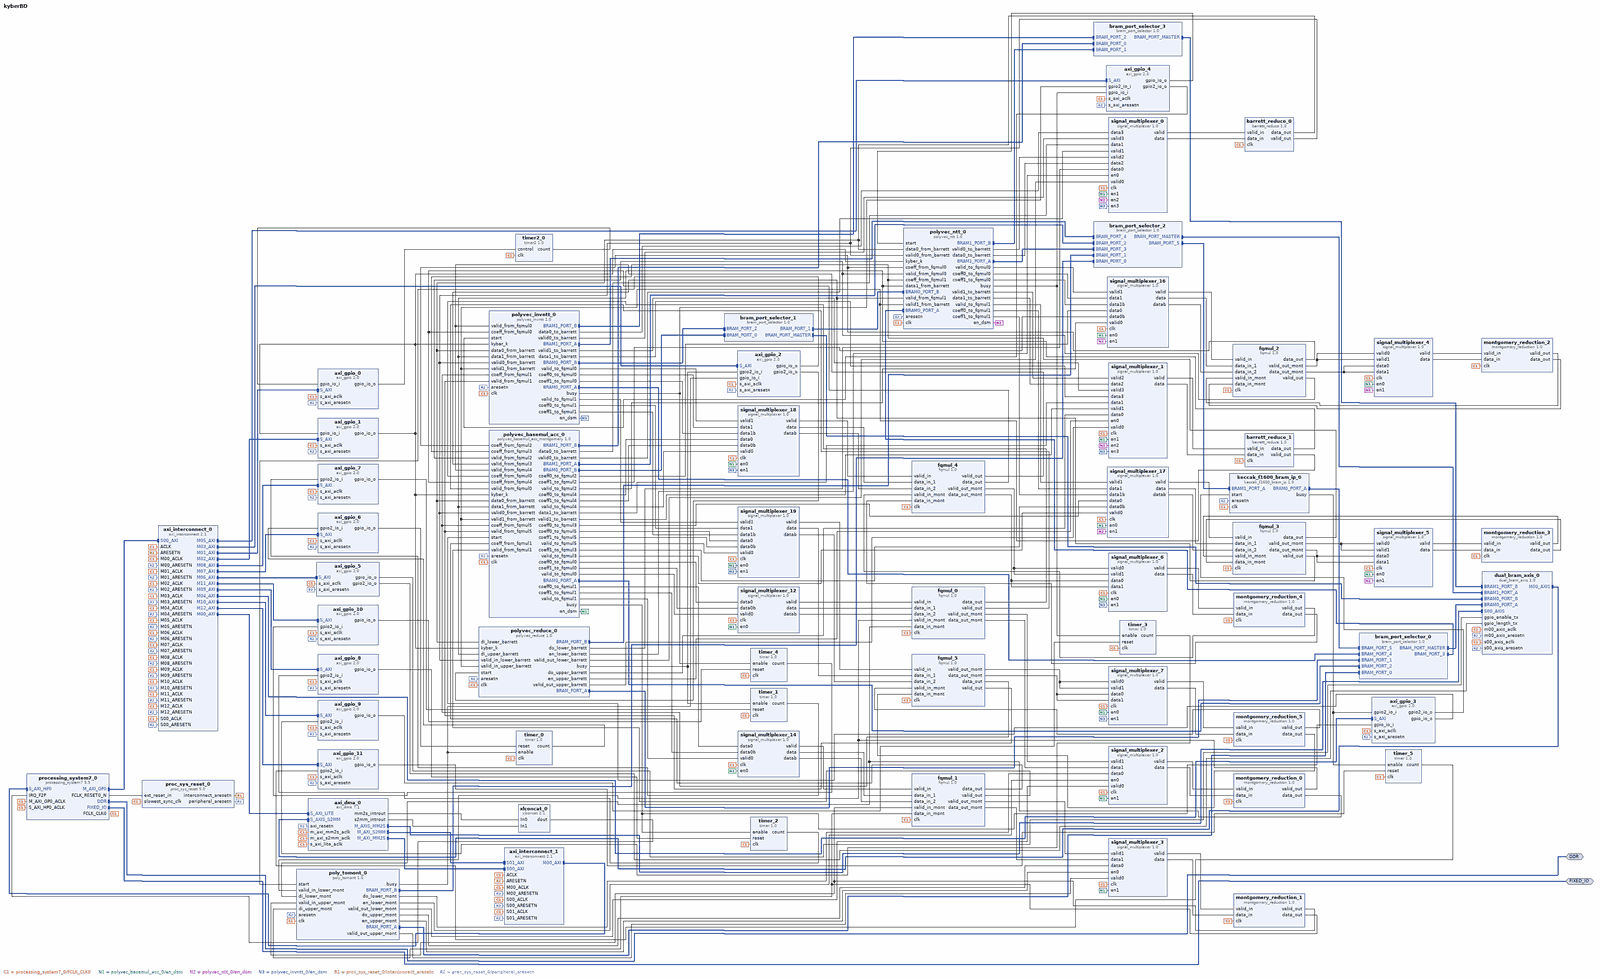
[diagram p0: block diagram of the top level, whole]
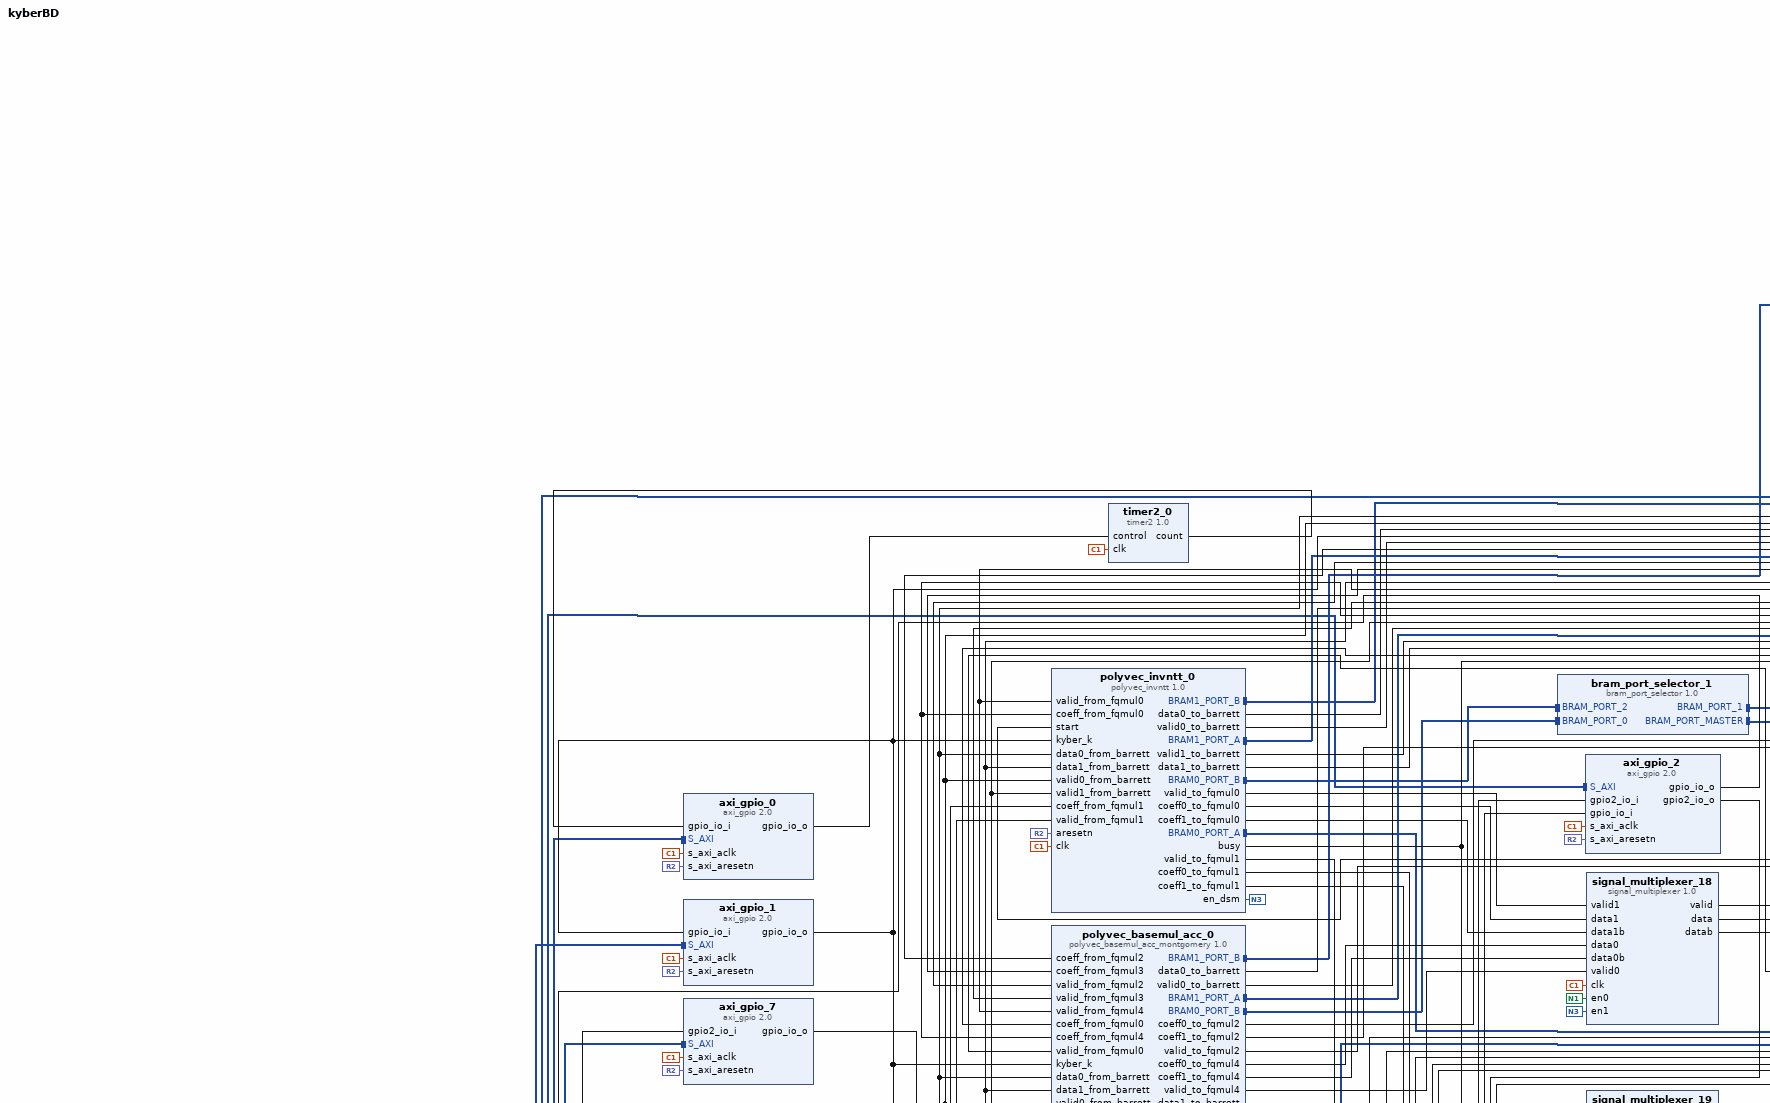
[diagram p1: block diagram of the top level, upper left part]
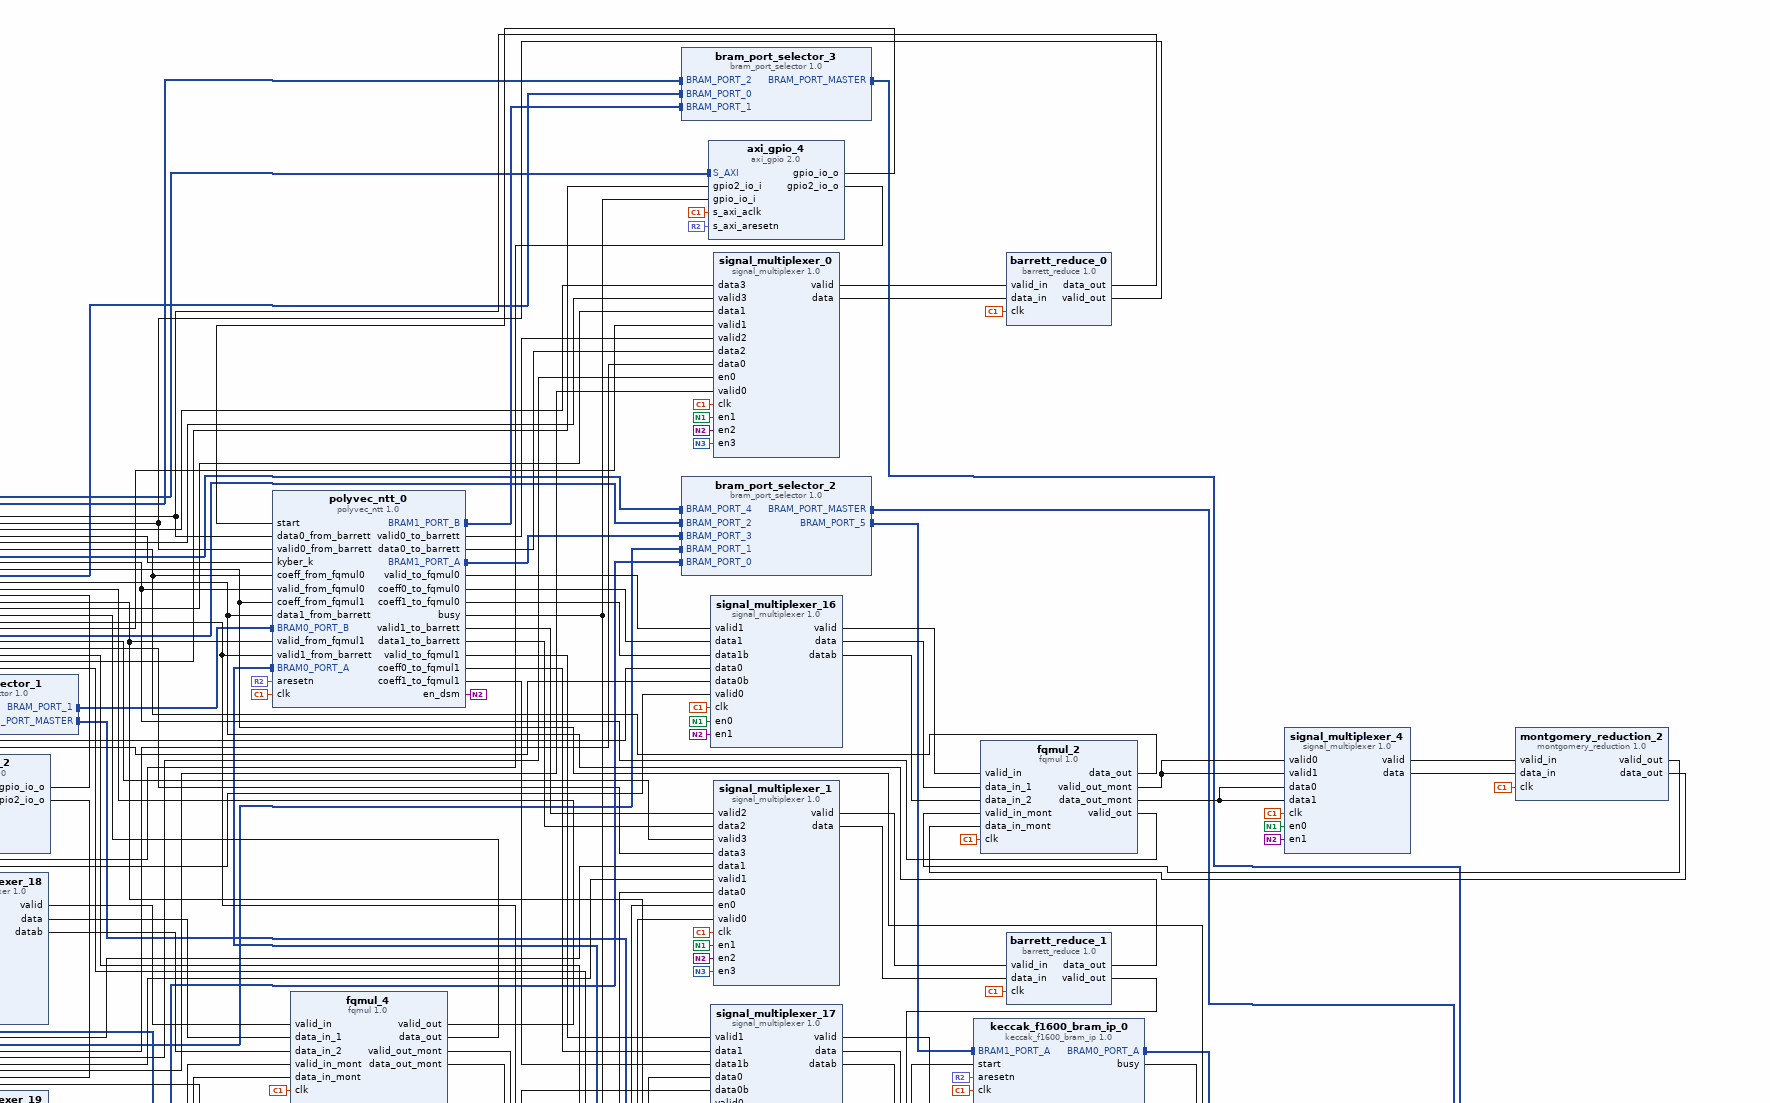
[diagram p2: block diagram of the top level, upper right part]
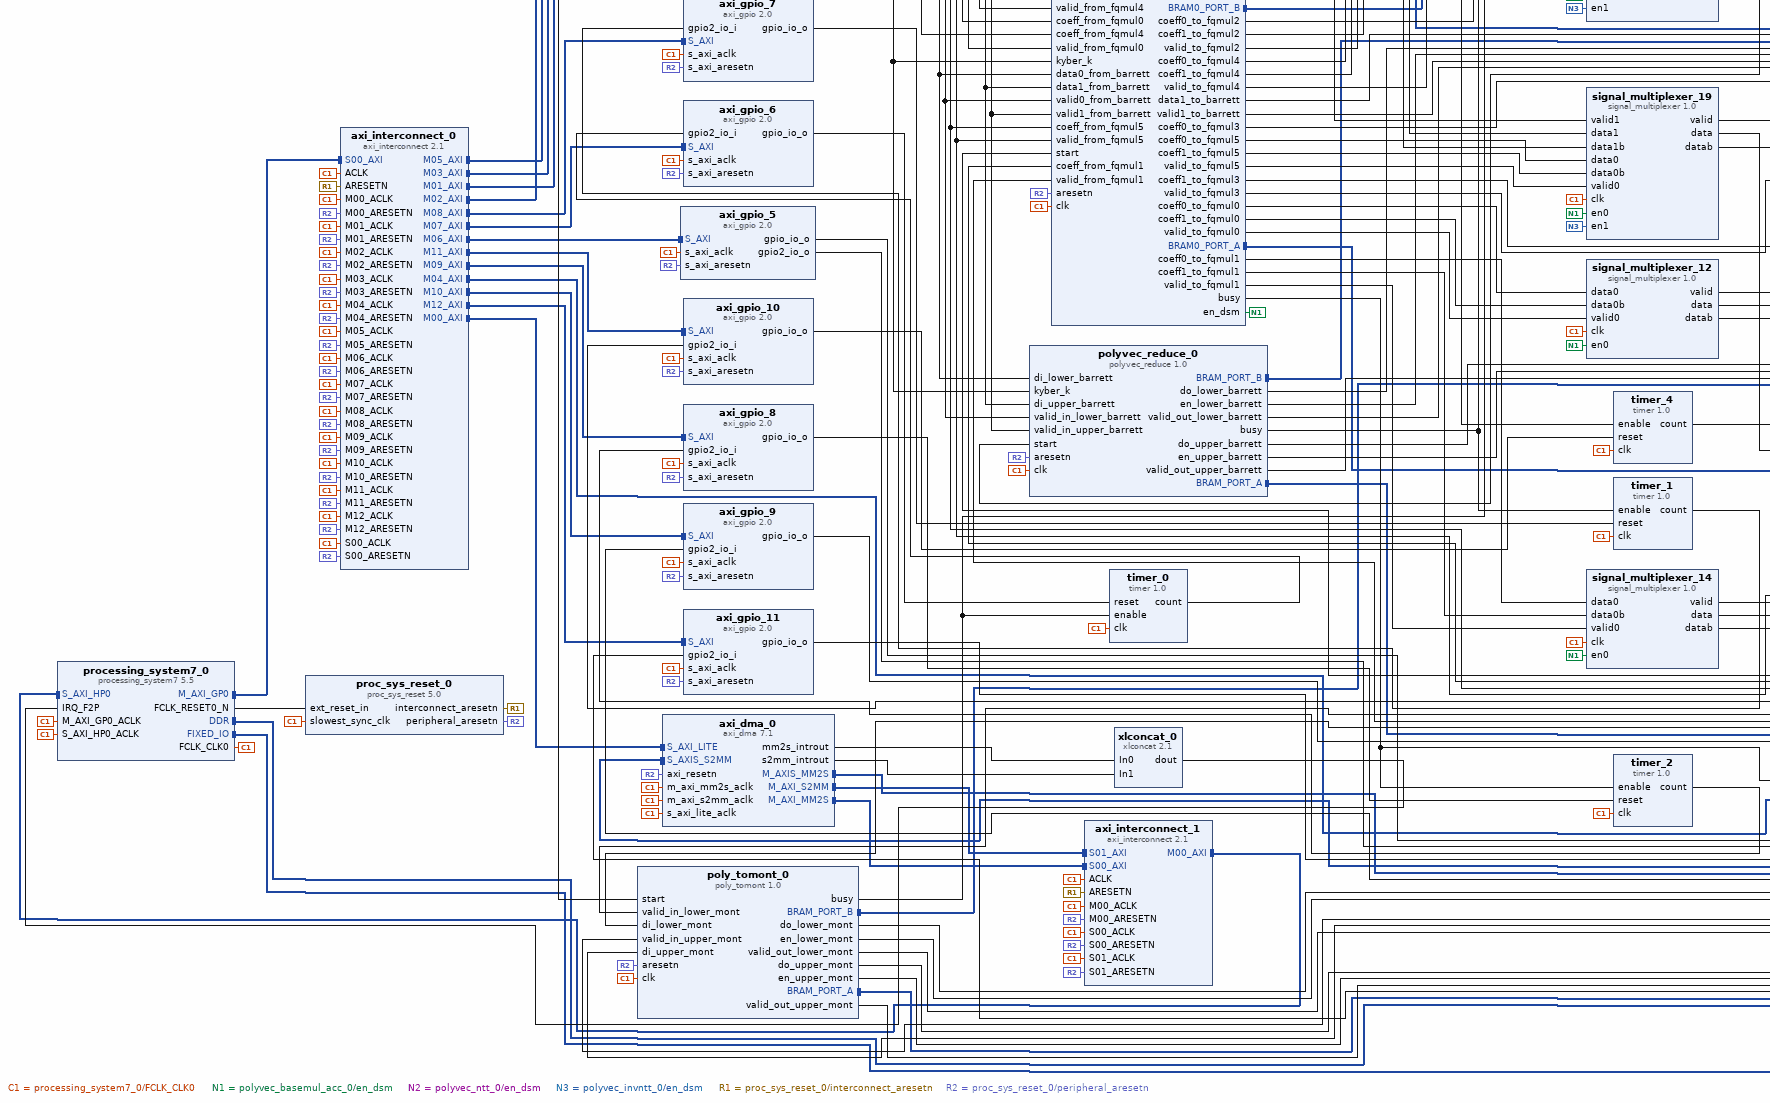
[diagram p3: block diagram of the top level, lower left part]
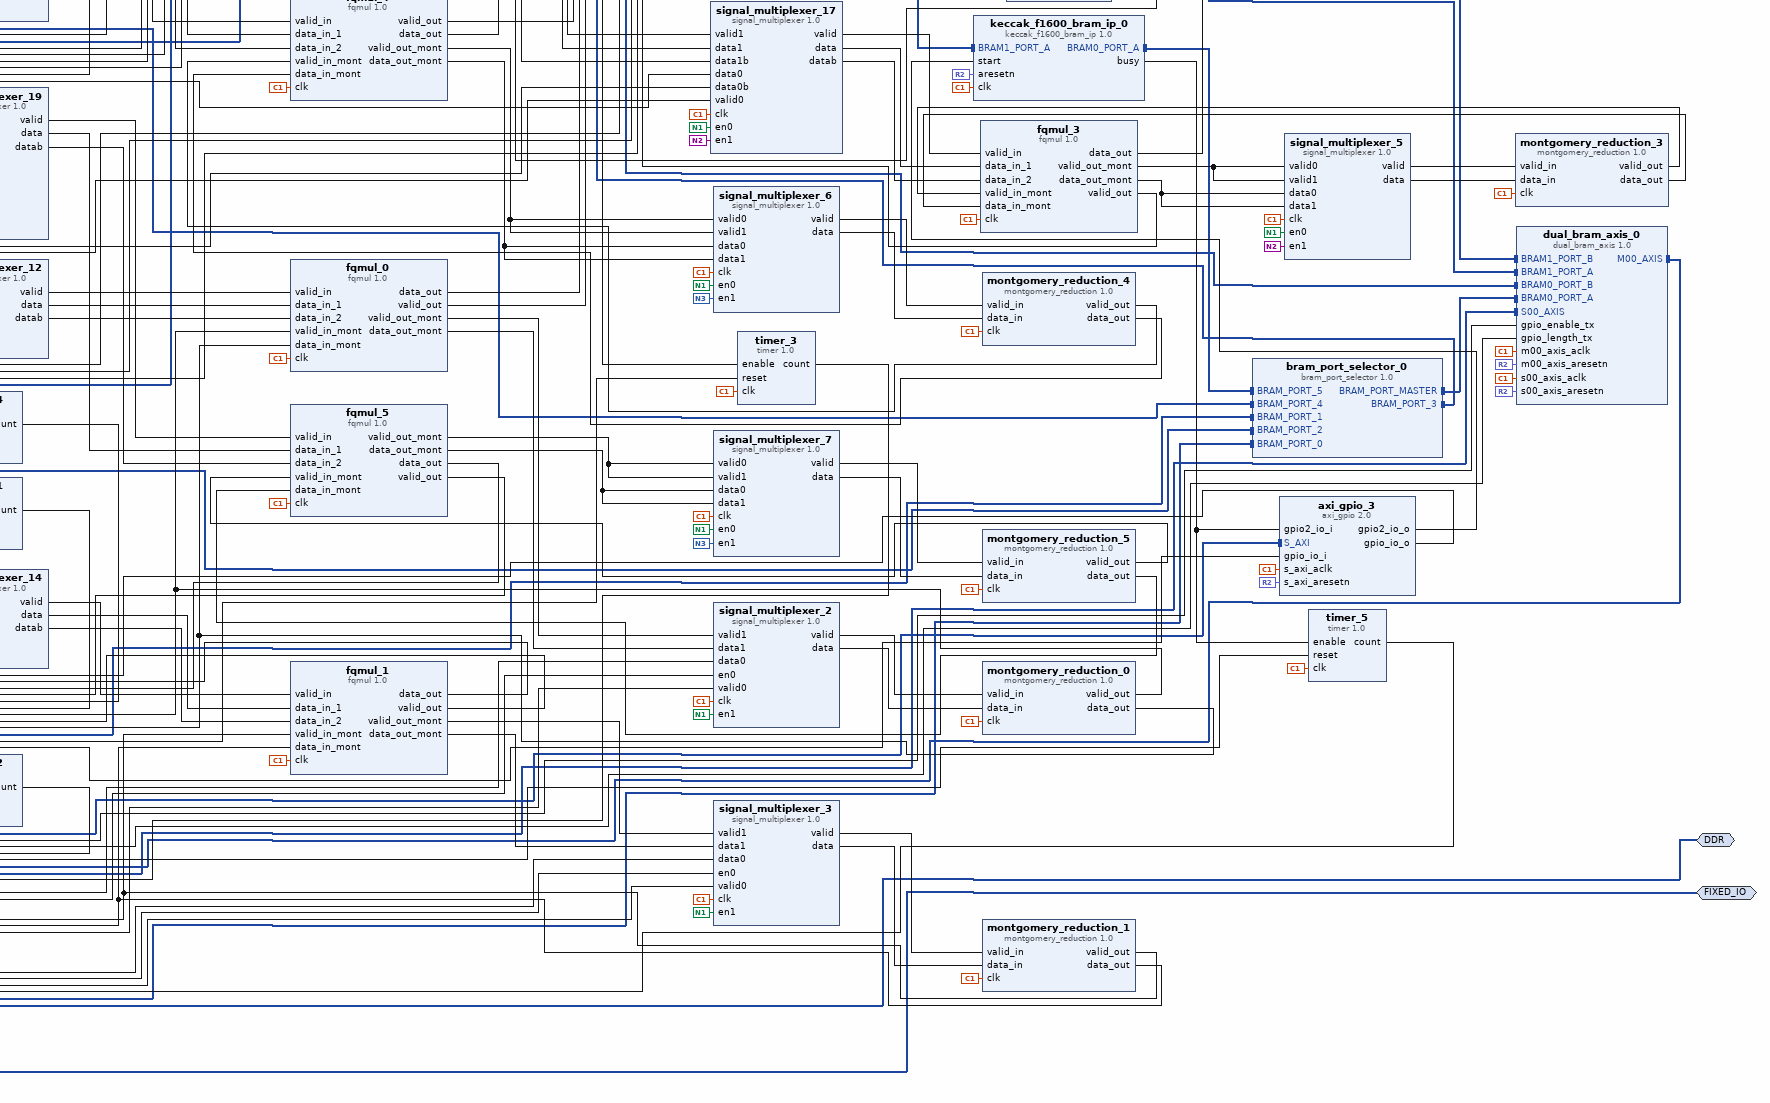
[diagram p4: block diagram of the top level, lower right part]
# Vivado block design kyberBD, xc7z010clg400-1, Vivado 2019.1
create_bd_design kyberBD

create_bd_intf_port -mode Master -vlnv xilinx.com:interface:ddrx_rtl:1.0 DDR
create_bd_intf_port -mode Master -vlnv xilinx.com:display_processing_system7:fixedio_rtl:1.0 FIXED_IO

create_bd_cell -type ip -vlnv xilinx.com:ip:processing_system7:5.5 processing_system7_0
set_property -dict [list \
  CONFIG.PCW_APU_PERIPHERAL_FREQMHZ 667 \
  CONFIG.PCW_ENET0_ENET0_IO {MIO 16 .. 27} \
  CONFIG.PCW_ENET0_GRP_MDIO_ENABLE 1 \
  CONFIG.PCW_ENET0_GRP_MDIO_IO {MIO 52 .. 53} \
  CONFIG.PCW_ENET0_PERIPHERAL_ENABLE 1 \
  CONFIG.PCW_ENET0_RESET_ENABLE 0 \
  CONFIG.PCW_ENET_RESET_ENABLE 1 \
  CONFIG.PCW_ENET_RESET_SELECT {Share reset pin} \
  CONFIG.PCW_FPGA0_PERIPHERAL_FREQMHZ 100 \
  CONFIG.PCW_FPGA1_PERIPHERAL_FREQMHZ 100 \
  CONFIG.PCW_FPGA2_PERIPHERAL_FREQMHZ 33.333333 \
  CONFIG.PCW_GPIO_MIO_GPIO_ENABLE 1 \
  CONFIG.PCW_GPIO_MIO_GPIO_IO MIO \
  CONFIG.PCW_GPIO_PERIPHERAL_ENABLE 1 \
  CONFIG.PCW_I2C_RESET_ENABLE 0 \
  CONFIG.PCW_IRQ_F2P_INTR 1 \
  CONFIG.PCW_PRESET_BANK1_VOLTAGE {LVCMOS 1.8V} \
  CONFIG.PCW_QSPI_GRP_FBCLK_ENABLE 1 \
  CONFIG.PCW_QSPI_GRP_FBCLK_IO {MIO 8} \
  CONFIG.PCW_QSPI_GRP_SINGLE_SS_ENABLE 1 \
  CONFIG.PCW_QSPI_GRP_SINGLE_SS_IO {MIO 1 .. 6} \
  CONFIG.PCW_QSPI_PERIPHERAL_ENABLE 1 \
  CONFIG.PCW_QSPI_QSPI_IO {MIO 1 .. 6} \
  CONFIG.PCW_SD0_GRP_CD_ENABLE 1 \
  CONFIG.PCW_SD0_GRP_CD_IO {MIO 46} \
  CONFIG.PCW_SD0_GRP_WP_ENABLE 1 \
  CONFIG.PCW_SD0_GRP_WP_IO {MIO 50} \
  CONFIG.PCW_SD0_PERIPHERAL_ENABLE 1 \
  CONFIG.PCW_SD0_SD0_IO {MIO 40 .. 45} \
  CONFIG.PCW_SDIO_PERIPHERAL_FREQMHZ 25 \
  CONFIG.PCW_SINGLE_QSPI_DATA_MODE x4 \
  CONFIG.PCW_S_AXI_HP0_DATA_WIDTH 32 \
  CONFIG.PCW_TTC0_PERIPHERAL_ENABLE 1 \
  CONFIG.PCW_TTC0_TTC0_IO EMIO \
  CONFIG.PCW_UART0_PERIPHERAL_ENABLE 1 \
  CONFIG.PCW_UART0_UART0_IO {MIO 14 .. 15} \
  CONFIG.PCW_UART1_PERIPHERAL_ENABLE 1 \
  CONFIG.PCW_UART1_UART1_IO {MIO 48 .. 49} \
  CONFIG.PCW_UART_PERIPHERAL_FREQMHZ 50 \
  CONFIG.PCW_UIPARAM_DDR_PARTNO {MT41K256M16 RE-125} \
  CONFIG.PCW_USB0_PERIPHERAL_ENABLE 1 \
  CONFIG.PCW_USB0_RESET_ENABLE 1 \
  CONFIG.PCW_USB0_RESET_IO {MIO 7} \
  CONFIG.PCW_USB0_USB0_IO {MIO 28 .. 39} \
  CONFIG.PCW_USB_RESET_ENABLE 1 \
  CONFIG.PCW_USB_RESET_SELECT {Share reset pin} \
  CONFIG.PCW_USE_FABRIC_INTERRUPT 1 \
  CONFIG.PCW_USE_S_AXI_HP0 1 \
] [get_bd_cells processing_system7_0]
# 281 more settings of processing_system7_0 are not shown: defaults, MIO pin electricals, DDR timing, and values the tool derives
create_bd_cell -type ip -vlnv xilinx.com:ip:proc_sys_reset:5.0 proc_sys_reset_0
create_bd_cell -type ip -vlnv xilinx.com:ip:axi_interconnect:2.1 axi_interconnect_0
set_property -dict {CONFIG.NUM_MI 13} [get_bd_cells axi_interconnect_0]
create_bd_cell -type ip -vlnv xilinx.com:ip:axi_gpio:2.0 axi_gpio_0
set_property -dict [list \
  CONFIG.C_ALL_INPUTS 0 \
  CONFIG.C_ALL_OUTPUTS 0 \
  CONFIG.C_GPIO_WIDTH 32 \
  CONFIG.C_IS_DUAL 0 \
] [get_bd_cells axi_gpio_0]
create_bd_cell -type ip -vlnv xilinx.com:ip:axi_gpio:2.0 axi_gpio_1
set_property -dict [list \
  CONFIG.C_ALL_INPUTS 0 \
  CONFIG.C_ALL_OUTPUTS 0 \
  CONFIG.C_GPIO_WIDTH 3 \
  CONFIG.C_IS_DUAL 0 \
] [get_bd_cells axi_gpio_1]
create_bd_cell -type ip -vlnv xilinx.com:ip:axi_gpio:2.0 axi_gpio_2
set_property -dict {CONFIG.C_GPIO2_WIDTH 1 CONFIG.C_GPIO_WIDTH 1 CONFIG.C_IS_DUAL 1} [get_bd_cells axi_gpio_2]
create_bd_cell -type ip -vlnv xilinx.com:ip:axi_gpio:2.0 axi_gpio_3
set_property -dict {CONFIG.C_GPIO2_WIDTH 1 CONFIG.C_GPIO_WIDTH 1 CONFIG.C_IS_DUAL 1} [get_bd_cells axi_gpio_3]
create_bd_cell -type ip -vlnv xilinx.com:user:barrett_reduce:1.0 barrett_reduce_0
create_bd_cell -type ip -vlnv xilinx.com:user:barrett_reduce:1.0 barrett_reduce_1
create_bd_cell -type ip -vlnv xilinx.com:user:fqmul:1.0 fqmul_0
create_bd_cell -type ip -vlnv xilinx.com:user:fqmul:1.0 fqmul_1
create_bd_cell -type ip -vlnv xilinx.com:user:fqmul:1.0 fqmul_2
create_bd_cell -type ip -vlnv xilinx.com:user:fqmul:1.0 fqmul_3
create_bd_cell -type ip -vlnv xilinx.com:user:fqmul:1.0 fqmul_4
create_bd_cell -type ip -vlnv xilinx.com:user:fqmul:1.0 fqmul_5
create_bd_cell -type ip -vlnv xilinx.com:user:polyvec_reduce:1.0 polyvec_reduce_0
create_bd_cell -type ip -vlnv xilinx.com:user:timer2:1.0 timer2_0
create_bd_cell -type ip -vlnv xilinx.com:ip:axi_gpio:2.0 axi_gpio_4
set_property -dict {CONFIG.C_GPIO2_WIDTH 1 CONFIG.C_GPIO_WIDTH 1 CONFIG.C_IS_DUAL 1} [get_bd_cells axi_gpio_4]
create_bd_cell -type ip -vlnv xilinx.com:user:signal_multiplexer:1.0 signal_multiplexer_0
set_property -dict {CONFIG.DATA_WIDTH 16 CONFIG.NUMBER_OF_CHANNELS 4} [get_bd_cells signal_multiplexer_0]
create_bd_cell -type ip -vlnv xilinx.com:user:signal_multiplexer:1.0 signal_multiplexer_1
set_property -dict {CONFIG.DATA_WIDTH 16 CONFIG.NUMBER_OF_CHANNELS 4} [get_bd_cells signal_multiplexer_1]
create_bd_cell -type ip -vlnv xilinx.com:user:signal_multiplexer:1.0 signal_multiplexer_12
set_property -dict [list \
  CONFIG.DATA_WIDTH 16 \
  CONFIG.ENABLE_SECOND_DATA_CHANNEL true \
  CONFIG.NUMBER_OF_CHANNELS 1 \
] [get_bd_cells signal_multiplexer_12]
create_bd_cell -type ip -vlnv xilinx.com:user:signal_multiplexer:1.0 signal_multiplexer_14
set_property -dict [list \
  CONFIG.DATA_WIDTH 16 \
  CONFIG.ENABLE_SECOND_DATA_CHANNEL true \
  CONFIG.NUMBER_OF_CHANNELS 1 \
] [get_bd_cells signal_multiplexer_14]
create_bd_cell -type ip -vlnv xilinx.com:user:signal_multiplexer:1.0 signal_multiplexer_16
set_property -dict [list \
  CONFIG.DATA_WIDTH 16 \
  CONFIG.ENABLE_SECOND_DATA_CHANNEL true \
  CONFIG.NUMBER_OF_CHANNELS 2 \
] [get_bd_cells signal_multiplexer_16]
create_bd_cell -type ip -vlnv xilinx.com:user:signal_multiplexer:1.0 signal_multiplexer_17
set_property -dict [list \
  CONFIG.DATA_WIDTH 16 \
  CONFIG.ENABLE_SECOND_DATA_CHANNEL true \
  CONFIG.NUMBER_OF_CHANNELS 2 \
] [get_bd_cells signal_multiplexer_17]
create_bd_cell -type ip -vlnv xilinx.com:user:signal_multiplexer:1.0 signal_multiplexer_18
set_property -dict [list \
  CONFIG.DATA_WIDTH 16 \
  CONFIG.ENABLE_SECOND_DATA_CHANNEL true \
  CONFIG.NUMBER_OF_CHANNELS 2 \
] [get_bd_cells signal_multiplexer_18]
create_bd_cell -type ip -vlnv xilinx.com:user:signal_multiplexer:1.0 signal_multiplexer_19
set_property -dict [list \
  CONFIG.DATA_WIDTH 16 \
  CONFIG.ENABLE_SECOND_DATA_CHANNEL true \
  CONFIG.NUMBER_OF_CHANNELS 2 \
] [get_bd_cells signal_multiplexer_19]
create_bd_cell -type ip -vlnv xilinx.com:user:signal_multiplexer:1.0 signal_multiplexer_2
create_bd_cell -type ip -vlnv xilinx.com:user:signal_multiplexer:1.0 signal_multiplexer_3
create_bd_cell -type ip -vlnv xilinx.com:user:signal_multiplexer:1.0 signal_multiplexer_4
set_property -dict {CONFIG.NUMBER_OF_CHANNELS 2} [get_bd_cells signal_multiplexer_4]
create_bd_cell -type ip -vlnv xilinx.com:user:signal_multiplexer:1.0 signal_multiplexer_5
set_property -dict {CONFIG.NUMBER_OF_CHANNELS 2} [get_bd_cells signal_multiplexer_5]
create_bd_cell -type ip -vlnv xilinx.com:user:signal_multiplexer:1.0 signal_multiplexer_6
set_property -dict {CONFIG.NUMBER_OF_CHANNELS 2} [get_bd_cells signal_multiplexer_6]
create_bd_cell -type ip -vlnv xilinx.com:user:signal_multiplexer:1.0 signal_multiplexer_7
set_property -dict {CONFIG.NUMBER_OF_CHANNELS 2} [get_bd_cells signal_multiplexer_7]
create_bd_cell -type ip -vlnv xilinx.com:user:montgomery_reduction:1.0 montgomery_reduction_0
create_bd_cell -type ip -vlnv xilinx.com:user:montgomery_reduction:1.0 montgomery_reduction_1
create_bd_cell -type ip -vlnv xilinx.com:user:montgomery_reduction:1.0 montgomery_reduction_2
create_bd_cell -type ip -vlnv xilinx.com:user:montgomery_reduction:1.0 montgomery_reduction_3
create_bd_cell -type ip -vlnv xilinx.com:user:montgomery_reduction:1.0 montgomery_reduction_4
create_bd_cell -type ip -vlnv xilinx.com:user:montgomery_reduction:1.0 montgomery_reduction_5
create_bd_cell -type ip -vlnv xilinx.com:ip:axi_dma:7.1 axi_dma_0
set_property -dict {CONFIG.c_include_sg 0 CONFIG.c_micro_dma 0 CONFIG.c_sg_length_width 22} [get_bd_cells axi_dma_0]
create_bd_cell -type ip -vlnv xilinx.com:ip:xlconcat:2.1 xlconcat_0
create_bd_cell -type ip -vlnv xilinx.com:ip:axi_gpio:2.0 axi_gpio_5
set_property -dict [list \
  CONFIG.C_ALL_OUTPUTS 1 \
  CONFIG.C_ALL_OUTPUTS_2 1 \
  CONFIG.C_GPIO_WIDTH 1 \
  CONFIG.C_IS_DUAL 1 \
] [get_bd_cells axi_gpio_5]
create_bd_cell -type ip -vlnv xilinx.com:user:poly_tomont:1.0 poly_tomont_0
set_property -dict {CONFIG.ADDR_WIDTH 11} [get_bd_cells poly_tomont_0]
create_bd_cell -type ip -vlnv xilinx.com:user:polyvec_basemul_acc_montgomery:1.0 polyvec_basemul_acc_0
create_bd_cell -type ip -vlnv xilinx.com:user:bram_port_selector:1.0 bram_port_selector_0
set_property -dict {CONFIG.ADDR_WIDTH 11 CONFIG.NUMBER_OF_CHANNELS 6} [get_bd_cells bram_port_selector_0]
create_bd_cell -type ip -vlnv xilinx.com:user:bram_port_selector:1.0 bram_port_selector_1
set_property -dict {CONFIG.ADDR_WIDTH 11 CONFIG.NUMBER_OF_CHANNELS 3} [get_bd_cells bram_port_selector_1]
create_bd_cell -type ip -vlnv xilinx.com:user:bram_port_selector:1.0 bram_port_selector_3
set_property -dict {CONFIG.ADDR_WIDTH 11 CONFIG.NUMBER_OF_CHANNELS 3} [get_bd_cells bram_port_selector_3]
create_bd_cell -type ip -vlnv xilinx.com:user:bram_port_selector:1.0 bram_port_selector_2
set_property -dict {CONFIG.NUMBER_OF_CHANNELS 6} [get_bd_cells bram_port_selector_2]
create_bd_cell -type ip -vlnv xilinx.com:user:dual_bram_axis:1.0 dual_bram_axis_0
create_bd_cell -type ip -vlnv xilinx.com:user:keccak_f1600_bram_ip:1.0 keccak_f1600_bram_ip_0
create_bd_cell -type ip -vlnv xilinx.com:user:polyvec_invntt:1.0 polyvec_invntt_0
create_bd_cell -type ip -vlnv xilinx.com:user:polyvec_ntt:1.0 polyvec_ntt_0
create_bd_cell -type ip -vlnv xilinx.com:user:timer:1.0 timer_0
create_bd_cell -type ip -vlnv xilinx.com:user:timer:1.0 timer_1
create_bd_cell -type ip -vlnv xilinx.com:user:timer:1.0 timer_2
create_bd_cell -type ip -vlnv xilinx.com:user:timer:1.0 timer_3
create_bd_cell -type ip -vlnv xilinx.com:user:timer:1.0 timer_4
create_bd_cell -type ip -vlnv xilinx.com:user:timer:1.0 timer_5
create_bd_cell -type ip -vlnv xilinx.com:ip:axi_gpio:2.0 axi_gpio_6
set_property -dict [list \
  CONFIG.C_ALL_INPUTS_2 1 \
  CONFIG.C_ALL_OUTPUTS 1 \
  CONFIG.C_GPIO_WIDTH 1 \
  CONFIG.C_IS_DUAL 1 \
] [get_bd_cells axi_gpio_6]
create_bd_cell -type ip -vlnv xilinx.com:ip:axi_interconnect:2.1 axi_interconnect_1
set_property -dict {CONFIG.NUM_MI 1 CONFIG.NUM_SI 2} [get_bd_cells axi_interconnect_1]
create_bd_cell -type ip -vlnv xilinx.com:ip:axi_gpio:2.0 axi_gpio_7
set_property -dict [list \
  CONFIG.C_ALL_INPUTS_2 1 \
  CONFIG.C_ALL_OUTPUTS 1 \
  CONFIG.C_GPIO_WIDTH 1 \
  CONFIG.C_IS_DUAL 1 \
] [get_bd_cells axi_gpio_7]
create_bd_cell -type ip -vlnv xilinx.com:ip:axi_gpio:2.0 axi_gpio_8
set_property -dict [list \
  CONFIG.C_ALL_INPUTS_2 1 \
  CONFIG.C_ALL_OUTPUTS 1 \
  CONFIG.C_GPIO_WIDTH 1 \
  CONFIG.C_IS_DUAL 1 \
] [get_bd_cells axi_gpio_8]
create_bd_cell -type ip -vlnv xilinx.com:ip:axi_gpio:2.0 axi_gpio_9
set_property -dict [list \
  CONFIG.C_ALL_INPUTS_2 1 \
  CONFIG.C_ALL_OUTPUTS 1 \
  CONFIG.C_GPIO_WIDTH 1 \
  CONFIG.C_IS_DUAL 1 \
] [get_bd_cells axi_gpio_9]
create_bd_cell -type ip -vlnv xilinx.com:ip:axi_gpio:2.0 axi_gpio_10
set_property -dict [list \
  CONFIG.C_ALL_INPUTS_2 1 \
  CONFIG.C_ALL_OUTPUTS 1 \
  CONFIG.C_GPIO_WIDTH 1 \
  CONFIG.C_IS_DUAL 1 \
] [get_bd_cells axi_gpio_10]
create_bd_cell -type ip -vlnv xilinx.com:ip:axi_gpio:2.0 axi_gpio_11
set_property -dict [list \
  CONFIG.C_ALL_INPUTS_2 1 \
  CONFIG.C_ALL_OUTPUTS 1 \
  CONFIG.C_GPIO_WIDTH 1 \
  CONFIG.C_IS_DUAL 1 \
] [get_bd_cells axi_gpio_11]

# ---- connections ----

connect_bd_intf_net [get_bd_intf_pins axi_gpio_11/S_AXI] [get_bd_intf_pins axi_interconnect_0/M12_AXI]
connect_bd_intf_net [get_bd_intf_pins axi_gpio_8/S_AXI] [get_bd_intf_pins axi_interconnect_0/M09_AXI]
connect_bd_intf_net [get_bd_intf_pins axi_gpio_7/S_AXI] [get_bd_intf_pins axi_interconnect_0/M08_AXI]
connect_bd_intf_net [get_bd_intf_pins axi_gpio_9/S_AXI] [get_bd_intf_pins axi_interconnect_0/M10_AXI]
connect_bd_intf_net [get_bd_intf_pins processing_system7_0/S_AXI_HP0] [get_bd_intf_pins axi_interconnect_1/M00_AXI]
connect_bd_intf_net [get_bd_intf_pins bram_port_selector_2/BRAM_PORT_MASTER] [get_bd_intf_pins dual_bram_axis_0/BRAM1_PORT_A]
connect_bd_intf_net [get_bd_intf_pins polyvec_ntt_0/BRAM1_PORT_B] [get_bd_intf_pins bram_port_selector_3/BRAM_PORT_1]
connect_bd_intf_net [get_bd_intf_pins dual_bram_axis_0/S00_AXIS] [get_bd_intf_pins axi_dma_0/M_AXIS_MM2S]
connect_bd_intf_net [get_bd_intf_pins axi_dma_0/M_AXI_S2MM] [get_bd_intf_pins axi_interconnect_1/S01_AXI]
connect_bd_intf_net [get_bd_intf_pins bram_port_selector_0/BRAM_PORT_MASTER] [get_bd_intf_pins dual_bram_axis_0/BRAM0_PORT_A]
connect_bd_intf_net [get_bd_intf_pins bram_port_selector_1/BRAM_PORT_MASTER] [get_bd_intf_pins dual_bram_axis_0/BRAM0_PORT_B]
connect_bd_intf_net -intf_net polyvec_invntt_0_BRAM_PORT_B [get_bd_intf_pins polyvec_invntt_0/BRAM0_PORT_B] [get_bd_intf_pins bram_port_selector_1/BRAM_PORT_2]
connect_bd_intf_net [get_bd_intf_pins polyvec_basemul_acc_0/BRAM1_PORT_B] [get_bd_intf_pins bram_port_selector_3/BRAM_PORT_0]
connect_bd_intf_net [get_bd_intf_pins axi_interconnect_0/M04_AXI] [get_bd_intf_pins axi_gpio_3/S_AXI]
connect_bd_intf_net -intf_net polyvec_ntt_0_BRAM_PORT_B [get_bd_intf_pins bram_port_selector_1/BRAM_PORT_1] [get_bd_intf_pins polyvec_ntt_0/BRAM0_PORT_B]
connect_bd_intf_net [get_bd_intf_pins poly_tomont_0/BRAM_PORT_A] [get_bd_intf_pins bram_port_selector_0/BRAM_PORT_0]
connect_bd_intf_net [get_bd_intf_pins polyvec_invntt_0/BRAM1_PORT_A] [get_bd_intf_pins bram_port_selector_2/BRAM_PORT_4]
connect_bd_intf_net -intf_net polyvec_invntt_0_BRAM_PORT_A [get_bd_intf_pins polyvec_invntt_0/BRAM0_PORT_A] [get_bd_intf_pins bram_port_selector_0/BRAM_PORT_4]
connect_bd_intf_net -intf_net keccak_f1600_bram_ip_0_PORT_BRAM [get_bd_intf_pins keccak_f1600_bram_ip_0/BRAM0_PORT_A] [get_bd_intf_pins bram_port_selector_0/BRAM_PORT_5]
connect_bd_intf_net [get_bd_intf_pins polyvec_reduce_0/BRAM_PORT_A] [get_bd_intf_pins bram_port_selector_0/BRAM_PORT_1]
connect_bd_intf_net [get_bd_intf_pins polyvec_basemul_acc_0/BRAM0_PORT_A] [get_bd_intf_pins bram_port_selector_0/BRAM_PORT_2]
connect_bd_intf_net [get_bd_intf_pins polyvec_basemul_acc_0/BRAM0_PORT_B] [get_bd_intf_pins bram_port_selector_1/BRAM_PORT_0]
connect_bd_intf_net [get_bd_intf_pins processing_system7_0/M_AXI_GP0] [get_bd_intf_pins axi_interconnect_0/S00_AXI]
connect_bd_intf_net [get_bd_intf_pins axi_interconnect_0/M02_AXI] [get_bd_intf_pins axi_gpio_1/S_AXI]
connect_bd_intf_net [get_bd_intf_pins axi_dma_0/S_AXI_LITE] [get_bd_intf_pins axi_interconnect_0/M00_AXI]
connect_bd_intf_net [get_bd_intf_pins polyvec_ntt_0/BRAM1_PORT_A] [get_bd_intf_pins bram_port_selector_2/BRAM_PORT_3]
connect_bd_intf_net [get_bd_intf_pins bram_port_selector_2/BRAM_PORT_5] [get_bd_intf_pins keccak_f1600_bram_ip_0/BRAM1_PORT_A]
connect_bd_intf_net [get_bd_intf_pins polyvec_basemul_acc_0/BRAM1_PORT_A] [get_bd_intf_pins bram_port_selector_2/BRAM_PORT_2]
connect_bd_intf_net [get_bd_intf_ports DDR] [get_bd_intf_pins processing_system7_0/DDR]
connect_bd_intf_net -intf_net polyvec_ntt_0_BRAM_PORT_A [get_bd_intf_pins bram_port_selector_0/BRAM_PORT_3] [get_bd_intf_pins polyvec_ntt_0/BRAM0_PORT_A]
connect_bd_intf_net [get_bd_intf_pins bram_port_selector_3/BRAM_PORT_MASTER] [get_bd_intf_pins dual_bram_axis_0/BRAM1_PORT_B]
connect_bd_intf_net [get_bd_intf_pins polyvec_reduce_0/BRAM_PORT_B] [get_bd_intf_pins bram_port_selector_2/BRAM_PORT_1]
connect_bd_intf_net [get_bd_intf_pins polyvec_invntt_0/BRAM1_PORT_B] [get_bd_intf_pins bram_port_selector_3/BRAM_PORT_2]
connect_bd_intf_net [get_bd_intf_pins axi_gpio_5/S_AXI] [get_bd_intf_pins axi_interconnect_0/M06_AXI]
connect_bd_intf_net [get_bd_intf_pins poly_tomont_0/BRAM_PORT_B] [get_bd_intf_pins bram_port_selector_2/BRAM_PORT_0]
connect_bd_intf_net [get_bd_intf_pins dual_bram_axis_0/M00_AXIS] [get_bd_intf_pins axi_dma_0/S_AXIS_S2MM]
connect_bd_intf_net [get_bd_intf_ports FIXED_IO] [get_bd_intf_pins processing_system7_0/FIXED_IO]
connect_bd_intf_net [get_bd_intf_pins axi_gpio_6/S_AXI] [get_bd_intf_pins axi_interconnect_0/M07_AXI]
connect_bd_intf_net [get_bd_intf_pins axi_interconnect_0/M05_AXI] [get_bd_intf_pins axi_gpio_4/S_AXI]
connect_bd_intf_net [get_bd_intf_pins axi_gpio_10/S_AXI] [get_bd_intf_pins axi_interconnect_0/M11_AXI]
connect_bd_intf_net [get_bd_intf_pins axi_dma_0/M_AXI_MM2S] [get_bd_intf_pins axi_interconnect_1/S00_AXI]
connect_bd_intf_net [get_bd_intf_pins axi_interconnect_0/M03_AXI] [get_bd_intf_pins axi_gpio_2/S_AXI]
connect_bd_intf_net [get_bd_intf_pins axi_gpio_0/S_AXI] [get_bd_intf_pins axi_interconnect_0/M01_AXI]
connect_bd_net [get_bd_pins processing_system7_0/FCLK_RESET0_N] [get_bd_pins proc_sys_reset_0/ext_reset_in]
connect_bd_net [get_bd_pins axi_gpio_0/gpio_io_o] [get_bd_pins timer2_0/control]
connect_bd_net [get_bd_pins timer2_0/count] [get_bd_pins axi_gpio_0/gpio_io_i]
connect_bd_net [get_bd_pins poly_tomont_0/busy] [get_bd_pins axi_gpio_2/gpio_io_i] [get_bd_pins timer_0/enable]
connect_bd_net [get_bd_pins axi_gpio_2/gpio_io_o] [get_bd_pins poly_tomont_0/start]
connect_bd_net [get_bd_pins axi_gpio_1/gpio_io_o] \
  [get_bd_pins axi_gpio_1/gpio_io_i] [get_bd_pins polyvec_reduce_0/kyber_k] [get_bd_pins polyvec_basemul_acc_0/kyber_k] \
  [get_bd_pins polyvec_invntt_0/kyber_k] [get_bd_pins polyvec_ntt_0/kyber_k]
connect_bd_net [get_bd_pins axi_gpio_2/gpio2_io_o] [get_bd_pins polyvec_reduce_0/start]
connect_bd_net [get_bd_pins polyvec_reduce_0/busy] [get_bd_pins axi_gpio_2/gpio2_io_i] [get_bd_pins timer_1/enable]
connect_bd_net [get_bd_pins axi_gpio_3/gpio_io_o] [get_bd_pins polyvec_basemul_acc_0/start]
connect_bd_net [get_bd_pins polyvec_basemul_acc_0/busy] [get_bd_pins axi_gpio_3/gpio_io_i] [get_bd_pins timer_2/enable]
connect_bd_net [get_bd_pins processing_system7_0/FCLK_CLK0] \
  [get_bd_pins proc_sys_reset_0/slowest_sync_clk] [get_bd_pins processing_system7_0/M_AXI_GP0_ACLK] \
  [get_bd_pins axi_interconnect_0/M01_ACLK] [get_bd_pins axi_interconnect_0/M00_ACLK] \
  [get_bd_pins axi_interconnect_0/S00_ACLK] [get_bd_pins axi_interconnect_0/ACLK] [get_bd_pins axi_gpio_0/s_axi_aclk] \
  [get_bd_pins axi_gpio_1/s_axi_aclk] [get_bd_pins axi_interconnect_0/M02_ACLK] [get_bd_pins axi_interconnect_0/M03_ACLK] \
  [get_bd_pins axi_gpio_2/s_axi_aclk] [get_bd_pins axi_interconnect_0/M04_ACLK] [get_bd_pins axi_gpio_3/s_axi_aclk] \
  [get_bd_pins axi_interconnect_0/M05_ACLK] [get_bd_pins barrett_reduce_0/clk] [get_bd_pins barrett_reduce_1/clk] \
  [get_bd_pins fqmul_0/clk] [get_bd_pins fqmul_1/clk] [get_bd_pins fqmul_2/clk] [get_bd_pins fqmul_3/clk] \
  [get_bd_pins fqmul_4/clk] [get_bd_pins fqmul_5/clk] [get_bd_pins polyvec_reduce_0/clk] [get_bd_pins timer2_0/clk] \
  [get_bd_pins axi_gpio_4/s_axi_aclk] [get_bd_pins signal_multiplexer_0/clk] [get_bd_pins signal_multiplexer_1/clk] \
  [get_bd_pins signal_multiplexer_12/clk] [get_bd_pins signal_multiplexer_14/clk] [get_bd_pins signal_multiplexer_16/clk] \
  [get_bd_pins signal_multiplexer_17/clk] [get_bd_pins signal_multiplexer_18/clk] [get_bd_pins signal_multiplexer_19/clk] \
  [get_bd_pins signal_multiplexer_2/clk] [get_bd_pins signal_multiplexer_3/clk] [get_bd_pins signal_multiplexer_4/clk] \
  [get_bd_pins signal_multiplexer_5/clk] [get_bd_pins signal_multiplexer_6/clk] [get_bd_pins signal_multiplexer_7/clk] \
  [get_bd_pins montgomery_reduction_0/clk] [get_bd_pins montgomery_reduction_1/clk] [get_bd_pins montgomery_reduction_2/clk] \
  [get_bd_pins montgomery_reduction_3/clk] [get_bd_pins montgomery_reduction_4/clk] [get_bd_pins montgomery_reduction_5/clk] \
  [get_bd_pins axi_dma_0/s_axi_lite_aclk] [get_bd_pins axi_dma_0/m_axi_mm2s_aclk] \
  [get_bd_pins processing_system7_0/S_AXI_HP0_ACLK] [get_bd_pins axi_dma_0/m_axi_s2mm_aclk] \
  [get_bd_pins axi_gpio_5/s_axi_aclk] [get_bd_pins axi_interconnect_0/M06_ACLK] [get_bd_pins poly_tomont_0/clk] \
  [get_bd_pins polyvec_basemul_acc_0/clk] [get_bd_pins dual_bram_axis_0/m00_axis_aclk] \
  [get_bd_pins dual_bram_axis_0/s00_axis_aclk] [get_bd_pins keccak_f1600_bram_ip_0/clk] [get_bd_pins polyvec_invntt_0/clk] \
  [get_bd_pins polyvec_ntt_0/clk] [get_bd_pins timer_5/clk] [get_bd_pins timer_4/clk] [get_bd_pins timer_3/clk] \
  [get_bd_pins timer_2/clk] [get_bd_pins timer_1/clk] [get_bd_pins timer_0/clk] [get_bd_pins axi_gpio_6/s_axi_aclk] \
  [get_bd_pins axi_interconnect_0/M07_ACLK] [get_bd_pins axi_interconnect_0/M08_ACLK] \
  [get_bd_pins axi_interconnect_0/M09_ACLK] [get_bd_pins axi_interconnect_1/ACLK] [get_bd_pins axi_interconnect_1/S00_ACLK] \
  [get_bd_pins axi_interconnect_1/M00_ACLK] [get_bd_pins axi_interconnect_1/S01_ACLK] [get_bd_pins axi_gpio_11/s_axi_aclk] \
  [get_bd_pins axi_gpio_10/s_axi_aclk] [get_bd_pins axi_gpio_9/s_axi_aclk] [get_bd_pins axi_gpio_8/s_axi_aclk] \
  [get_bd_pins axi_gpio_7/s_axi_aclk] [get_bd_pins axi_interconnect_0/M10_ACLK] [get_bd_pins axi_interconnect_0/M11_ACLK] \
  [get_bd_pins axi_interconnect_0/M12_ACLK]
connect_bd_net [get_bd_pins poly_tomont_0/do_lower_mont] [get_bd_pins signal_multiplexer_2/data0]
connect_bd_net [get_bd_pins poly_tomont_0/en_lower_mont] [get_bd_pins signal_multiplexer_2/en0]
connect_bd_net [get_bd_pins poly_tomont_0/valid_out_lower_mont] [get_bd_pins signal_multiplexer_2/valid0]
connect_bd_net [get_bd_pins poly_tomont_0/do_upper_mont] [get_bd_pins signal_multiplexer_3/data0]
connect_bd_net [get_bd_pins poly_tomont_0/en_upper_mont] [get_bd_pins signal_multiplexer_3/en0]
connect_bd_net [get_bd_pins poly_tomont_0/valid_out_upper_mont] [get_bd_pins signal_multiplexer_3/valid0]
connect_bd_net [get_bd_pins fqmul_0/valid_out_mont] [get_bd_pins signal_multiplexer_2/valid1]
connect_bd_net [get_bd_pins fqmul_0/data_out_mont] [get_bd_pins signal_multiplexer_2/data1]
connect_bd_net [get_bd_pins fqmul_1/valid_out_mont] [get_bd_pins signal_multiplexer_3/valid1]
connect_bd_net [get_bd_pins fqmul_1/data_out_mont] [get_bd_pins signal_multiplexer_3/data1]
connect_bd_net [get_bd_pins fqmul_2/valid_out_mont] [get_bd_pins signal_multiplexer_4/valid0] [get_bd_pins signal_multiplexer_4/valid1]
connect_bd_net [get_bd_pins fqmul_2/data_out_mont] [get_bd_pins signal_multiplexer_4/data0] [get_bd_pins signal_multiplexer_4/data1]
connect_bd_net [get_bd_pins fqmul_3/valid_out_mont] [get_bd_pins signal_multiplexer_5/valid0] [get_bd_pins signal_multiplexer_5/valid1]
connect_bd_net [get_bd_pins fqmul_3/data_out_mont] [get_bd_pins signal_multiplexer_5/data0] [get_bd_pins signal_multiplexer_5/data1]
connect_bd_net [get_bd_pins fqmul_4/valid_out_mont] [get_bd_pins signal_multiplexer_6/valid0] [get_bd_pins signal_multiplexer_6/valid1]
connect_bd_net [get_bd_pins fqmul_4/data_out_mont] [get_bd_pins signal_multiplexer_6/data0] [get_bd_pins signal_multiplexer_6/data1]
connect_bd_net [get_bd_pins fqmul_5/valid_out_mont] [get_bd_pins signal_multiplexer_7/valid0] [get_bd_pins signal_multiplexer_7/valid1]
connect_bd_net [get_bd_pins fqmul_5/data_out_mont] [get_bd_pins signal_multiplexer_7/data0] [get_bd_pins signal_multiplexer_7/data1]
connect_bd_net [get_bd_pins montgomery_reduction_0/valid_out] [get_bd_pins fqmul_0/valid_in_mont] [get_bd_pins poly_tomont_0/valid_in_lower_mont]
connect_bd_net [get_bd_pins montgomery_reduction_0/data_out] [get_bd_pins fqmul_0/data_in_mont] [get_bd_pins poly_tomont_0/di_lower_mont]
connect_bd_net [get_bd_pins montgomery_reduction_1/valid_out] [get_bd_pins fqmul_1/valid_in_mont] [get_bd_pins poly_tomont_0/valid_in_upper_mont]
connect_bd_net [get_bd_pins montgomery_reduction_1/data_out] [get_bd_pins fqmul_1/data_in_mont] [get_bd_pins poly_tomont_0/di_upper_mont]
connect_bd_net [get_bd_pins fqmul_0/data_out] [get_bd_pins polyvec_basemul_acc_0/coeff_from_fqmul0]
connect_bd_net [get_bd_pins fqmul_1/data_out] [get_bd_pins polyvec_basemul_acc_0/coeff_from_fqmul1]
connect_bd_net [get_bd_pins fqmul_2/data_out] [get_bd_pins polyvec_basemul_acc_0/coeff_from_fqmul2] [get_bd_pins polyvec_ntt_0/coeff_from_fqmul0]
connect_bd_net [get_bd_pins fqmul_3/data_out] [get_bd_pins polyvec_basemul_acc_0/coeff_from_fqmul3] [get_bd_pins polyvec_ntt_0/coeff_from_fqmul1]
connect_bd_net [get_bd_pins montgomery_reduction_2/valid_out] [get_bd_pins fqmul_2/valid_in_mont]
connect_bd_net [get_bd_pins montgomery_reduction_2/data_out] [get_bd_pins fqmul_2/data_in_mont]
connect_bd_net [get_bd_pins montgomery_reduction_3/valid_out] [get_bd_pins fqmul_3/valid_in_mont]
connect_bd_net [get_bd_pins montgomery_reduction_3/data_out] [get_bd_pins fqmul_3/data_in_mont]
connect_bd_net [get_bd_pins montgomery_reduction_4/valid_out] [get_bd_pins fqmul_4/valid_in_mont]
connect_bd_net [get_bd_pins montgomery_reduction_4/data_out] [get_bd_pins fqmul_4/data_in_mont]
connect_bd_net [get_bd_pins montgomery_reduction_5/valid_out] [get_bd_pins fqmul_5/valid_in_mont]
connect_bd_net [get_bd_pins montgomery_reduction_5/data_out] [get_bd_pins fqmul_5/data_in_mont]
connect_bd_net [get_bd_pins barrett_reduce_0/data_out] \
  [get_bd_pins polyvec_reduce_0/di_lower_barrett] [get_bd_pins polyvec_basemul_acc_0/data0_from_barrett] \
  [get_bd_pins polyvec_invntt_0/data0_from_barrett] [get_bd_pins polyvec_ntt_0/data0_from_barrett]
connect_bd_net [get_bd_pins barrett_reduce_1/data_out] \
  [get_bd_pins polyvec_reduce_0/di_upper_barrett] [get_bd_pins polyvec_basemul_acc_0/data1_from_barrett] \
  [get_bd_pins polyvec_invntt_0/data1_from_barrett] [get_bd_pins polyvec_ntt_0/data1_from_barrett]
connect_bd_net [get_bd_pins polyvec_basemul_acc_0/en_dsm] \
  [get_bd_pins signal_multiplexer_12/en0] [get_bd_pins signal_multiplexer_14/en0] [get_bd_pins signal_multiplexer_16/en0] \
  [get_bd_pins signal_multiplexer_17/en0] [get_bd_pins signal_multiplexer_18/en0] [get_bd_pins signal_multiplexer_19/en0] \
  [get_bd_pins signal_multiplexer_2/en1] [get_bd_pins signal_multiplexer_3/en1] [get_bd_pins signal_multiplexer_4/en0] \
  [get_bd_pins signal_multiplexer_5/en0] [get_bd_pins signal_multiplexer_6/en0] [get_bd_pins signal_multiplexer_7/en0] \
  [get_bd_pins signal_multiplexer_0/en1] [get_bd_pins signal_multiplexer_1/en1]
connect_bd_net [get_bd_pins polyvec_basemul_acc_0/data0_to_barrett] [get_bd_pins signal_multiplexer_0/data1]
connect_bd_net [get_bd_pins polyvec_basemul_acc_0/data1_to_barrett] [get_bd_pins signal_multiplexer_1/data1]
connect_bd_net [get_bd_pins polyvec_reduce_0/do_lower_barrett] [get_bd_pins signal_multiplexer_0/data0]
connect_bd_net [get_bd_pins polyvec_reduce_0/en_lower_barrett] [get_bd_pins signal_multiplexer_0/en0]
connect_bd_net [get_bd_pins polyvec_reduce_0/valid_out_lower_barrett] [get_bd_pins signal_multiplexer_0/valid0]
connect_bd_net [get_bd_pins polyvec_reduce_0/do_upper_barrett] [get_bd_pins signal_multiplexer_1/data0]
connect_bd_net [get_bd_pins polyvec_reduce_0/en_upper_barrett] [get_bd_pins signal_multiplexer_1/en0]
connect_bd_net [get_bd_pins polyvec_reduce_0/valid_out_upper_barrett] [get_bd_pins signal_multiplexer_1/valid0]
connect_bd_net [get_bd_pins barrett_reduce_0/valid_out] \
  [get_bd_pins polyvec_reduce_0/valid_in_lower_barrett] [get_bd_pins polyvec_basemul_acc_0/valid0_from_barrett] \
  [get_bd_pins polyvec_invntt_0/valid0_from_barrett] [get_bd_pins polyvec_ntt_0/valid0_from_barrett]
connect_bd_net [get_bd_pins barrett_reduce_1/valid_out] \
  [get_bd_pins polyvec_reduce_0/valid_in_upper_barrett] [get_bd_pins polyvec_basemul_acc_0/valid1_from_barrett] \
  [get_bd_pins polyvec_invntt_0/valid1_from_barrett] [get_bd_pins polyvec_ntt_0/valid1_from_barrett]
connect_bd_net [get_bd_pins fqmul_0/valid_out] [get_bd_pins polyvec_basemul_acc_0/valid_from_fqmul0]
connect_bd_net [get_bd_pins fqmul_1/valid_out] [get_bd_pins polyvec_basemul_acc_0/valid_from_fqmul1]
connect_bd_net [get_bd_pins fqmul_2/valid_out] [get_bd_pins polyvec_basemul_acc_0/valid_from_fqmul2] [get_bd_pins polyvec_ntt_0/valid_from_fqmul0]
connect_bd_net [get_bd_pins fqmul_3/valid_out] [get_bd_pins polyvec_basemul_acc_0/valid_from_fqmul3] [get_bd_pins polyvec_ntt_0/valid_from_fqmul1]
connect_bd_net [get_bd_pins polyvec_basemul_acc_0/valid1_to_barrett] [get_bd_pins signal_multiplexer_1/valid1]
connect_bd_net [get_bd_pins polyvec_ntt_0/valid_to_fqmul0] [get_bd_pins signal_multiplexer_16/valid1]
connect_bd_net [get_bd_pins polyvec_ntt_0/coeff0_to_fqmul0] [get_bd_pins signal_multiplexer_16/data1]
connect_bd_net [get_bd_pins polyvec_ntt_0/en_dsm] \
  [get_bd_pins signal_multiplexer_16/en1] [get_bd_pins signal_multiplexer_4/en1] [get_bd_pins signal_multiplexer_5/en1] \
  [get_bd_pins signal_multiplexer_17/en1] [get_bd_pins signal_multiplexer_0/en2] [get_bd_pins signal_multiplexer_1/en2]
connect_bd_net [get_bd_pins polyvec_ntt_0/coeff1_to_fqmul0] [get_bd_pins signal_multiplexer_16/data1b]
connect_bd_net [get_bd_pins polyvec_ntt_0/valid_to_fqmul1] [get_bd_pins signal_multiplexer_17/valid1]
connect_bd_net [get_bd_pins polyvec_ntt_0/coeff0_to_fqmul1] [get_bd_pins signal_multiplexer_17/data1]
connect_bd_net [get_bd_pins polyvec_ntt_0/coeff1_to_fqmul1] [get_bd_pins signal_multiplexer_17/data1b]
connect_bd_net [get_bd_pins polyvec_ntt_0/valid0_to_barrett] [get_bd_pins signal_multiplexer_0/valid2]
connect_bd_net [get_bd_pins polyvec_ntt_0/data0_to_barrett] [get_bd_pins signal_multiplexer_0/data2]
connect_bd_net [get_bd_pins polyvec_ntt_0/busy] [get_bd_pins axi_gpio_4/gpio_io_i] [get_bd_pins timer_3/enable]
connect_bd_net [get_bd_pins axi_gpio_4/gpio_io_o] [get_bd_pins polyvec_ntt_0/start]
connect_bd_net [get_bd_pins polyvec_basemul_acc_0/valid0_to_barrett] [get_bd_pins signal_multiplexer_0/valid1]
connect_bd_net [get_bd_pins polyvec_basemul_acc_0/coeff0_to_fqmul0] [get_bd_pins signal_multiplexer_12/data0]
connect_bd_net [get_bd_pins polyvec_basemul_acc_0/coeff1_to_fqmul0] [get_bd_pins signal_multiplexer_12/data0b]
connect_bd_net [get_bd_pins polyvec_basemul_acc_0/coeff0_to_fqmul1] [get_bd_pins signal_multiplexer_14/data0]
connect_bd_net [get_bd_pins polyvec_basemul_acc_0/coeff1_to_fqmul1] [get_bd_pins signal_multiplexer_14/data0b]
connect_bd_net [get_bd_pins polyvec_basemul_acc_0/coeff0_to_fqmul2] [get_bd_pins signal_multiplexer_16/data0]
connect_bd_net [get_bd_pins polyvec_basemul_acc_0/coeff1_to_fqmul2] [get_bd_pins signal_multiplexer_16/data0b]
connect_bd_net [get_bd_pins polyvec_basemul_acc_0/coeff0_to_fqmul3] [get_bd_pins signal_multiplexer_17/data0]
connect_bd_net [get_bd_pins polyvec_basemul_acc_0/coeff1_to_fqmul3] [get_bd_pins signal_multiplexer_17/data0b]
connect_bd_net [get_bd_pins polyvec_basemul_acc_0/coeff0_to_fqmul4] [get_bd_pins signal_multiplexer_18/data0]
connect_bd_net [get_bd_pins polyvec_basemul_acc_0/coeff1_to_fqmul4] [get_bd_pins signal_multiplexer_18/data0b]
connect_bd_net [get_bd_pins polyvec_basemul_acc_0/coeff0_to_fqmul5] [get_bd_pins signal_multiplexer_19/data0]
connect_bd_net [get_bd_pins polyvec_basemul_acc_0/coeff1_to_fqmul5] [get_bd_pins signal_multiplexer_19/data0b]
connect_bd_net [get_bd_pins polyvec_basemul_acc_0/valid_to_fqmul0] [get_bd_pins signal_multiplexer_12/valid0]
connect_bd_net [get_bd_pins polyvec_basemul_acc_0/valid_to_fqmul1] [get_bd_pins signal_multiplexer_14/valid0]
connect_bd_net [get_bd_pins polyvec_basemul_acc_0/valid_to_fqmul3] [get_bd_pins signal_multiplexer_17/valid0]
connect_bd_net [get_bd_pins polyvec_basemul_acc_0/valid_to_fqmul4] [get_bd_pins signal_multiplexer_18/valid0]
connect_bd_net [get_bd_pins polyvec_basemul_acc_0/valid_to_fqmul5] [get_bd_pins signal_multiplexer_19/valid0]
connect_bd_net [get_bd_pins signal_multiplexer_0/valid] [get_bd_pins barrett_reduce_0/valid_in]
connect_bd_net [get_bd_pins signal_multiplexer_0/data] [get_bd_pins barrett_reduce_0/data_in]
connect_bd_net [get_bd_pins signal_multiplexer_1/valid] [get_bd_pins barrett_reduce_1/valid_in]
connect_bd_net [get_bd_pins signal_multiplexer_1/data] [get_bd_pins barrett_reduce_1/data_in]
connect_bd_net [get_bd_pins polyvec_ntt_0/valid1_to_barrett] [get_bd_pins signal_multiplexer_1/valid2]
connect_bd_net [get_bd_pins polyvec_ntt_0/data1_to_barrett] [get_bd_pins signal_multiplexer_1/data2]
connect_bd_net [get_bd_pins signal_multiplexer_2/valid] [get_bd_pins montgomery_reduction_0/valid_in]
connect_bd_net [get_bd_pins signal_multiplexer_2/data] [get_bd_pins montgomery_reduction_0/data_in]
connect_bd_net [get_bd_pins signal_multiplexer_3/valid] [get_bd_pins montgomery_reduction_1/valid_in]
connect_bd_net [get_bd_pins signal_multiplexer_3/data] [get_bd_pins montgomery_reduction_1/data_in]
connect_bd_net [get_bd_pins signal_multiplexer_4/valid] [get_bd_pins montgomery_reduction_2/valid_in]
connect_bd_net [get_bd_pins signal_multiplexer_4/data] [get_bd_pins montgomery_reduction_2/data_in]
connect_bd_net [get_bd_pins signal_multiplexer_5/valid] [get_bd_pins montgomery_reduction_3/valid_in]
connect_bd_net [get_bd_pins signal_multiplexer_5/data] [get_bd_pins montgomery_reduction_3/data_in]
connect_bd_net [get_bd_pins signal_multiplexer_6/valid] [get_bd_pins montgomery_reduction_4/valid_in]
connect_bd_net [get_bd_pins signal_multiplexer_6/data] [get_bd_pins montgomery_reduction_4/data_in]
connect_bd_net [get_bd_pins signal_multiplexer_7/valid] [get_bd_pins montgomery_reduction_5/valid_in]
connect_bd_net [get_bd_pins signal_multiplexer_7/data] [get_bd_pins montgomery_reduction_5/data_in]
connect_bd_net [get_bd_pins signal_multiplexer_12/valid] [get_bd_pins fqmul_0/valid_in]
connect_bd_net [get_bd_pins signal_multiplexer_12/data] [get_bd_pins fqmul_0/data_in_1]
connect_bd_net [get_bd_pins signal_multiplexer_14/valid] [get_bd_pins fqmul_1/valid_in]
connect_bd_net [get_bd_pins signal_multiplexer_14/data] [get_bd_pins fqmul_1/data_in_1]
connect_bd_net [get_bd_pins signal_multiplexer_16/valid] [get_bd_pins fqmul_2/valid_in]
connect_bd_net [get_bd_pins signal_multiplexer_16/data] [get_bd_pins fqmul_2/data_in_1]
connect_bd_net [get_bd_pins signal_multiplexer_12/datab] [get_bd_pins fqmul_0/data_in_2]
connect_bd_net [get_bd_pins signal_multiplexer_14/datab] [get_bd_pins fqmul_1/data_in_2]
connect_bd_net [get_bd_pins polyvec_basemul_acc_0/valid_to_fqmul2] [get_bd_pins signal_multiplexer_16/valid0]
connect_bd_net [get_bd_pins signal_multiplexer_16/datab] [get_bd_pins fqmul_2/data_in_2]
connect_bd_net [get_bd_pins signal_multiplexer_17/valid] [get_bd_pins fqmul_3/valid_in]
connect_bd_net [get_bd_pins signal_multiplexer_17/data] [get_bd_pins fqmul_3/data_in_1]
connect_bd_net [get_bd_pins signal_multiplexer_17/datab] [get_bd_pins fqmul_3/data_in_2]
connect_bd_net [get_bd_pins signal_multiplexer_18/valid] [get_bd_pins fqmul_4/valid_in]
connect_bd_net [get_bd_pins signal_multiplexer_18/data] [get_bd_pins fqmul_4/data_in_1]
connect_bd_net [get_bd_pins signal_multiplexer_18/datab] [get_bd_pins fqmul_4/data_in_2]
connect_bd_net [get_bd_pins signal_multiplexer_19/valid] [get_bd_pins fqmul_5/valid_in]
connect_bd_net [get_bd_pins signal_multiplexer_19/data] [get_bd_pins fqmul_5/data_in_1]
connect_bd_net [get_bd_pins signal_multiplexer_19/datab] [get_bd_pins fqmul_5/data_in_2]
connect_bd_net [get_bd_pins fqmul_4/valid_out] [get_bd_pins polyvec_basemul_acc_0/valid_from_fqmul4] [get_bd_pins polyvec_invntt_0/valid_from_fqmul0]
connect_bd_net [get_bd_pins fqmul_5/data_out] [get_bd_pins polyvec_basemul_acc_0/coeff_from_fqmul5] [get_bd_pins polyvec_invntt_0/coeff_from_fqmul1]
connect_bd_net [get_bd_pins fqmul_5/valid_out] [get_bd_pins polyvec_basemul_acc_0/valid_from_fqmul5] [get_bd_pins polyvec_invntt_0/valid_from_fqmul1]
connect_bd_net [get_bd_pins polyvec_invntt_0/valid_to_fqmul0] [get_bd_pins signal_multiplexer_18/valid1]
connect_bd_net [get_bd_pins polyvec_invntt_0/coeff0_to_fqmul0] [get_bd_pins signal_multiplexer_18/data1]
connect_bd_net [get_bd_pins polyvec_invntt_0/coeff1_to_fqmul0] [get_bd_pins signal_multiplexer_18/data1b]
connect_bd_net [get_bd_pins polyvec_invntt_0/en_dsm] \
  [get_bd_pins signal_multiplexer_19/en1] [get_bd_pins signal_multiplexer_18/en1] [get_bd_pins signal_multiplexer_7/en1] \
  [get_bd_pins signal_multiplexer_6/en1] [get_bd_pins signal_multiplexer_0/en3] [get_bd_pins signal_multiplexer_1/en3]
connect_bd_net [get_bd_pins polyvec_invntt_0/valid_to_fqmul1] [get_bd_pins signal_multiplexer_19/valid1]
connect_bd_net [get_bd_pins polyvec_invntt_0/coeff0_to_fqmul1] [get_bd_pins signal_multiplexer_19/data1]
connect_bd_net [get_bd_pins polyvec_invntt_0/coeff1_to_fqmul1] [get_bd_pins signal_multiplexer_19/data1b]
connect_bd_net [get_bd_pins polyvec_invntt_0/data0_to_barrett] [get_bd_pins signal_multiplexer_0/data3]
connect_bd_net [get_bd_pins polyvec_invntt_0/valid0_to_barrett] [get_bd_pins signal_multiplexer_0/valid3]
connect_bd_net [get_bd_pins polyvec_invntt_0/valid1_to_barrett] [get_bd_pins signal_multiplexer_1/valid3]
connect_bd_net [get_bd_pins polyvec_invntt_0/data1_to_barrett] [get_bd_pins signal_multiplexer_1/data3]
connect_bd_net [get_bd_pins axi_gpio_4/gpio2_io_o] [get_bd_pins polyvec_invntt_0/start]
connect_bd_net [get_bd_pins polyvec_invntt_0/busy] [get_bd_pins axi_gpio_4/gpio2_io_i] [get_bd_pins timer_4/enable]
connect_bd_net [get_bd_pins fqmul_4/data_out] [get_bd_pins polyvec_basemul_acc_0/coeff_from_fqmul4] [get_bd_pins polyvec_invntt_0/coeff_from_fqmul0]
connect_bd_net [get_bd_pins axi_gpio_3/gpio2_io_o] [get_bd_pins keccak_f1600_bram_ip_0/start]
connect_bd_net [get_bd_pins keccak_f1600_bram_ip_0/busy] [get_bd_pins axi_gpio_3/gpio2_io_i] [get_bd_pins timer_5/enable]
connect_bd_net [get_bd_pins proc_sys_reset_0/interconnect_aresetn] [get_bd_pins axi_interconnect_0/ARESETN] [get_bd_pins axi_interconnect_1/ARESETN]
connect_bd_net [get_bd_pins proc_sys_reset_0/peripheral_aresetn] \
  [get_bd_pins axi_interconnect_0/S00_ARESETN] [get_bd_pins axi_interconnect_0/M00_ARESETN] \
  [get_bd_pins axi_interconnect_0/M01_ARESETN] [get_bd_pins axi_interconnect_0/M02_ARESETN] \
  [get_bd_pins axi_interconnect_0/M03_ARESETN] [get_bd_pins axi_interconnect_0/M04_ARESETN] \
  [get_bd_pins axi_interconnect_0/M05_ARESETN] [get_bd_pins axi_dma_0/axi_resetn] [get_bd_pins axi_gpio_0/s_axi_aresetn] \
  [get_bd_pins axi_gpio_1/s_axi_aresetn] [get_bd_pins axi_gpio_2/s_axi_aresetn] [get_bd_pins axi_gpio_3/s_axi_aresetn] \
  [get_bd_pins axi_gpio_4/s_axi_aresetn] [get_bd_pins polyvec_reduce_0/aresetn] [get_bd_pins axi_gpio_5/s_axi_aresetn] \
  [get_bd_pins axi_interconnect_0/M06_ARESETN] [get_bd_pins poly_tomont_0/aresetn] \
  [get_bd_pins polyvec_basemul_acc_0/aresetn] [get_bd_pins dual_bram_axis_0/m00_axis_aresetn] \
  [get_bd_pins dual_bram_axis_0/s00_axis_aresetn] [get_bd_pins keccak_f1600_bram_ip_0/aresetn] \
  [get_bd_pins polyvec_invntt_0/aresetn] [get_bd_pins polyvec_ntt_0/aresetn] [get_bd_pins axi_gpio_6/s_axi_aresetn] \
  [get_bd_pins axi_interconnect_0/M07_ARESETN] [get_bd_pins axi_interconnect_0/M08_ARESETN] \
  [get_bd_pins axi_interconnect_0/M09_ARESETN] [get_bd_pins axi_interconnect_1/S00_ARESETN] \
  [get_bd_pins axi_interconnect_1/M00_ARESETN] [get_bd_pins axi_interconnect_1/S01_ARESETN] \
  [get_bd_pins axi_gpio_11/s_axi_aresetn] [get_bd_pins axi_gpio_10/s_axi_aresetn] [get_bd_pins axi_gpio_9/s_axi_aresetn] \
  [get_bd_pins axi_gpio_8/s_axi_aresetn] [get_bd_pins axi_gpio_7/s_axi_aresetn] [get_bd_pins axi_interconnect_0/M10_ARESETN] \
  [get_bd_pins axi_interconnect_0/M11_ARESETN] [get_bd_pins axi_interconnect_0/M12_ARESETN]
connect_bd_net [get_bd_pins xlconcat_0/dout] [get_bd_pins processing_system7_0/IRQ_F2P]
connect_bd_net [get_bd_pins axi_dma_0/mm2s_introut] [get_bd_pins xlconcat_0/In0]
connect_bd_net [get_bd_pins axi_dma_0/s2mm_introut] [get_bd_pins xlconcat_0/In1]
connect_bd_net [get_bd_pins axi_gpio_5/gpio_io_o] [get_bd_pins dual_bram_axis_0/gpio_enable_tx]
connect_bd_net [get_bd_pins axi_gpio_5/gpio2_io_o] [get_bd_pins dual_bram_axis_0/gpio_length_tx]
connect_bd_net [get_bd_pins axi_gpio_6/gpio_io_o] [get_bd_pins timer_0/reset]
connect_bd_net [get_bd_pins timer_0/count] [get_bd_pins axi_gpio_6/gpio2_io_i]
connect_bd_net [get_bd_pins axi_gpio_7/gpio_io_o] [get_bd_pins timer_1/reset]
connect_bd_net [get_bd_pins timer_1/count] [get_bd_pins axi_gpio_7/gpio2_io_i]
connect_bd_net [get_bd_pins axi_gpio_8/gpio_io_o] [get_bd_pins timer_2/reset]
connect_bd_net [get_bd_pins timer_2/count] [get_bd_pins axi_gpio_8/gpio2_io_i]
connect_bd_net [get_bd_pins axi_gpio_9/gpio_io_o] [get_bd_pins timer_3/reset]
connect_bd_net [get_bd_pins timer_3/count] [get_bd_pins axi_gpio_9/gpio2_io_i]
connect_bd_net [get_bd_pins axi_gpio_10/gpio_io_o] [get_bd_pins timer_4/reset]
connect_bd_net [get_bd_pins timer_4/count] [get_bd_pins axi_gpio_10/gpio2_io_i]
connect_bd_net [get_bd_pins axi_gpio_11/gpio_io_o] [get_bd_pins timer_5/reset]
connect_bd_net [get_bd_pins timer_5/count] [get_bd_pins axi_gpio_11/gpio2_io_i]

# ---- address map ----
assign_bd_address -offset 0x00000000 -range 1G -target_address_space [get_bd_addr_spaces axi_dma_0/Data_MM2S] [get_bd_addr_segs processing_system7_0/S_AXI_HP0/HP0_DDR_LOWOCM]
assign_bd_address -offset 0x00000000 -range 1G -target_address_space [get_bd_addr_spaces axi_dma_0/Data_S2MM] [get_bd_addr_segs processing_system7_0/S_AXI_HP0/HP0_DDR_LOWOCM]
assign_bd_address -offset 0x40400000 -range 64K -target_address_space [get_bd_addr_spaces processing_system7_0/Data] [get_bd_addr_segs axi_dma_0/S_AXI_LITE/Reg]
assign_bd_address -offset 0x41200000 -range 4K -target_address_space [get_bd_addr_spaces processing_system7_0/Data] [get_bd_addr_segs axi_gpio_0/S_AXI/Reg]
assign_bd_address -offset 0x41210000 -range 4K -target_address_space [get_bd_addr_spaces processing_system7_0/Data] [get_bd_addr_segs axi_gpio_1/S_AXI/Reg]
assign_bd_address -offset 0x41220000 -range 4K -target_address_space [get_bd_addr_spaces processing_system7_0/Data] [get_bd_addr_segs axi_gpio_2/S_AXI/Reg]
assign_bd_address -offset 0x41230000 -range 64K -target_address_space [get_bd_addr_spaces processing_system7_0/Data] [get_bd_addr_segs axi_gpio_3/S_AXI/Reg]
assign_bd_address -offset 0x41240000 -range 4K -target_address_space [get_bd_addr_spaces processing_system7_0/Data] [get_bd_addr_segs axi_gpio_4/S_AXI/Reg]
assign_bd_address -offset 0x41250000 -range 64K -target_address_space [get_bd_addr_spaces processing_system7_0/Data] [get_bd_addr_segs axi_gpio_5/S_AXI/Reg]
assign_bd_address -offset 0x41260000 -range 64K -target_address_space [get_bd_addr_spaces processing_system7_0/Data] [get_bd_addr_segs axi_gpio_6/S_AXI/Reg]
assign_bd_address -offset 0x41270000 -range 64K -target_address_space [get_bd_addr_spaces processing_system7_0/Data] [get_bd_addr_segs axi_gpio_7/S_AXI/Reg]
assign_bd_address -offset 0x41280000 -range 64K -target_address_space [get_bd_addr_spaces processing_system7_0/Data] [get_bd_addr_segs axi_gpio_8/S_AXI/Reg]
assign_bd_address -offset 0x41290000 -range 64K -target_address_space [get_bd_addr_spaces processing_system7_0/Data] [get_bd_addr_segs axi_gpio_9/S_AXI/Reg]
assign_bd_address -offset 0x412A0000 -range 64K -target_address_space [get_bd_addr_spaces processing_system7_0/Data] [get_bd_addr_segs axi_gpio_10/S_AXI/Reg]
assign_bd_address -offset 0x412B0000 -range 64K -target_address_space [get_bd_addr_spaces processing_system7_0/Data] [get_bd_addr_segs axi_gpio_11/S_AXI/Reg]

validate_bd_design
save_bd_design
